# EasyEDA Pro project JP_SENSOR.eprj

# Schematic Schematic1
Board Name: Board1; Create Date: 2025-06-28; Page Name: P2; Project Name: JP_Sensor; Schematic Name: Schematic1; Update Date: 2025-08-31; Company: EasyEDA.com; Page Size: A4; Version: V1.0
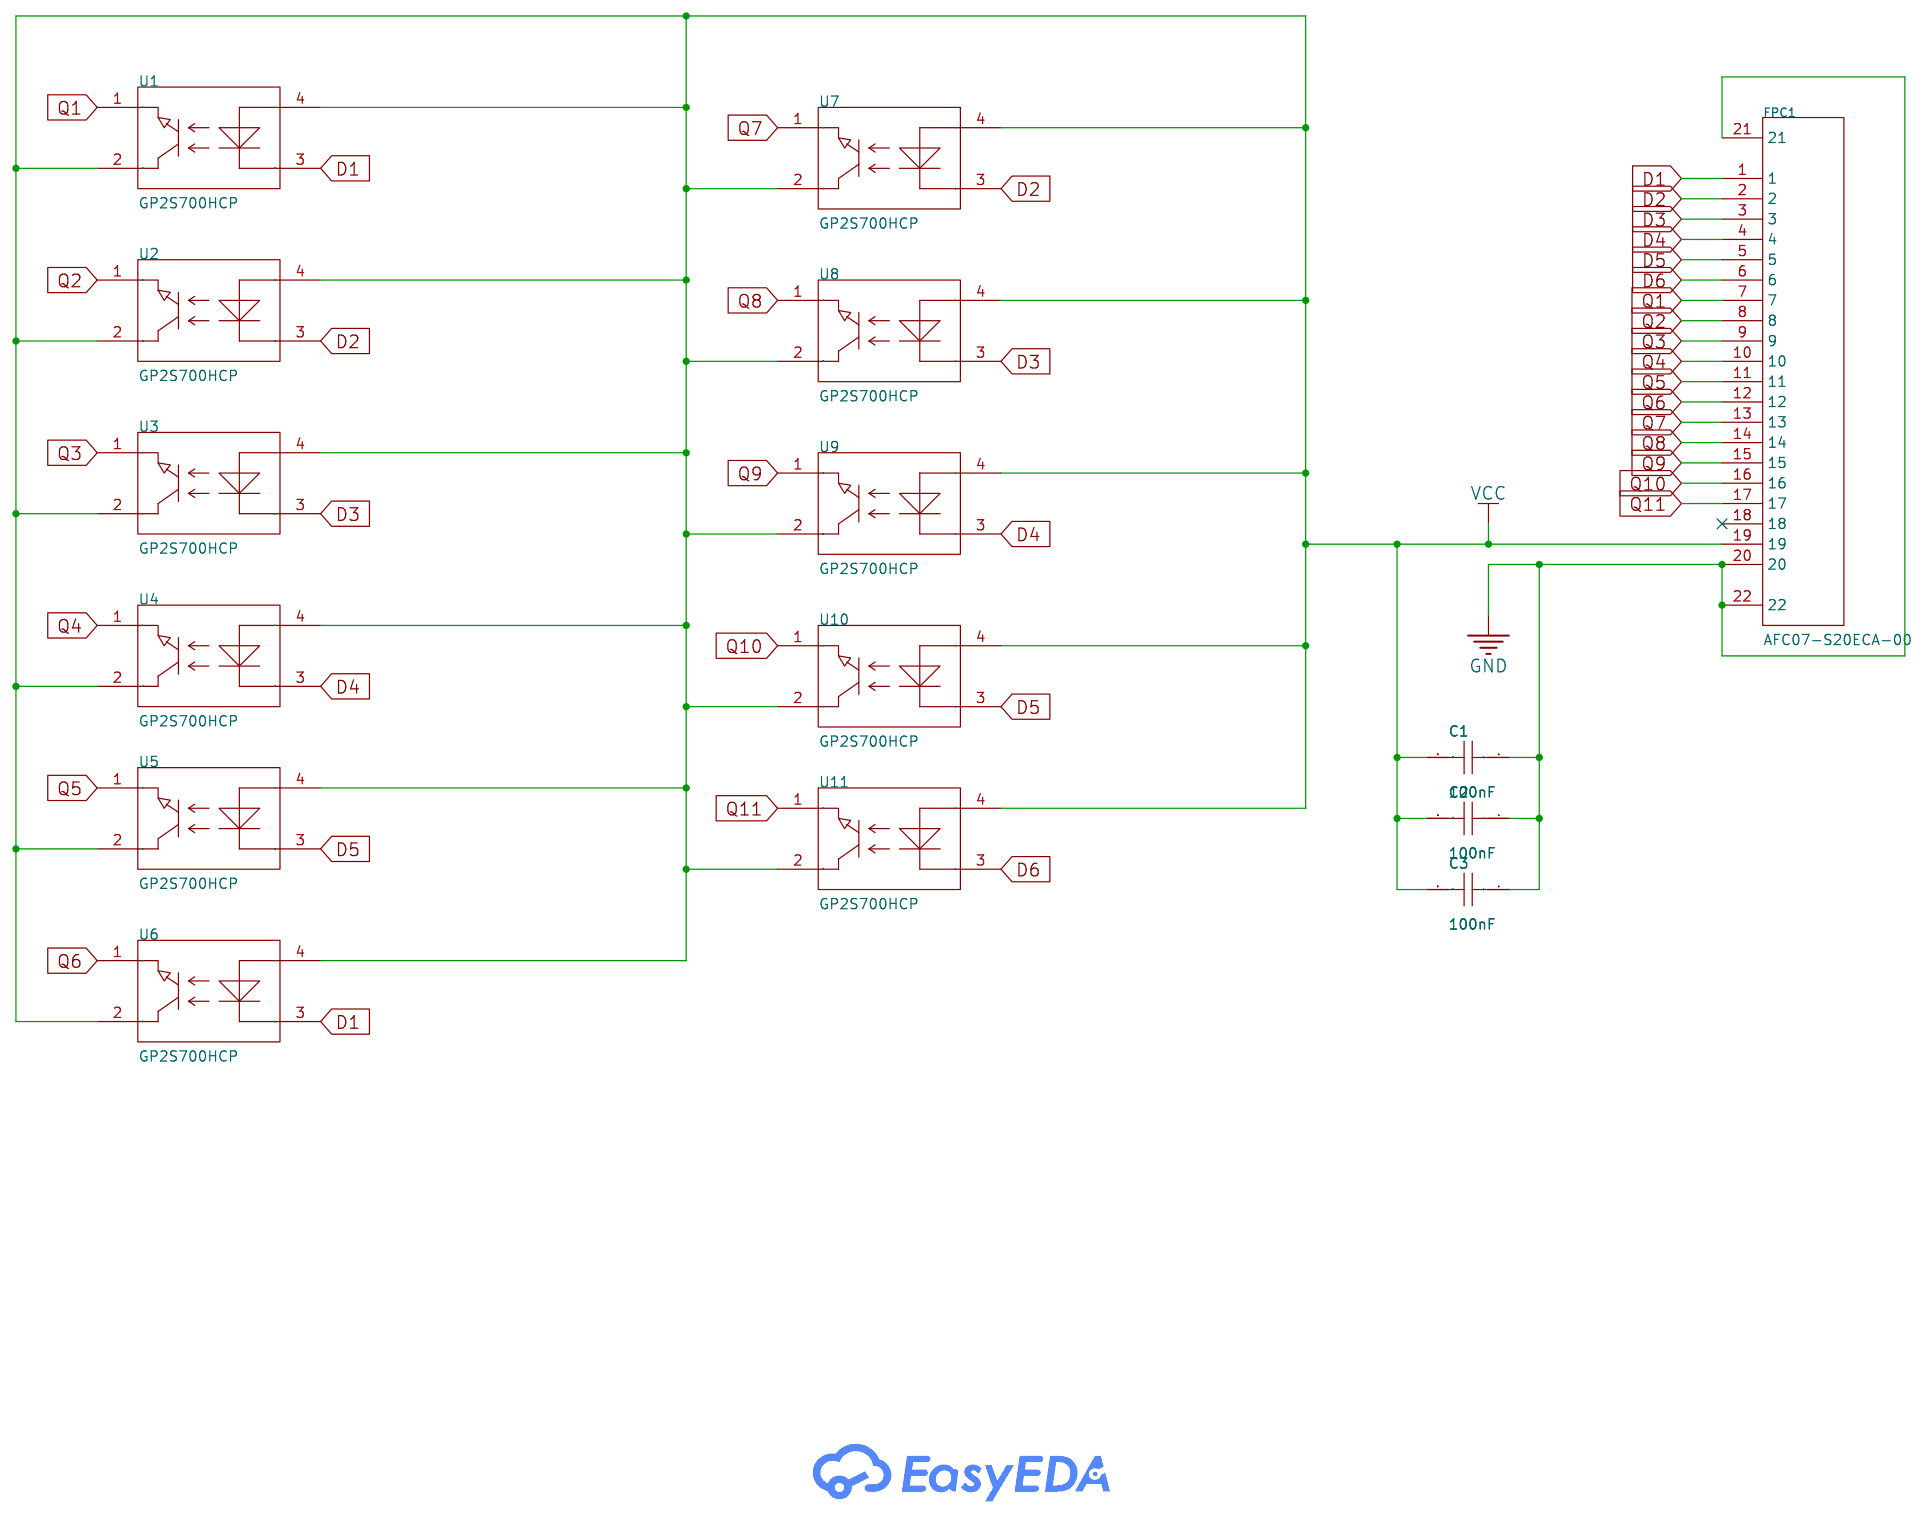
[diagram p0: schematic sheet]

## Parts
C1  100nF  [C0603]
C2  100nF  [C0603]
C3  100nF  [C0603]
FPC1  AFC07-S20ECA-00  [FPC-SMD_AFC07-S20ECA-00]
U1  GP2S700HCP  [OPTO-SMD_GP2S700HCP]
U2  GP2S700HCP  [OPTO-SMD_GP2S700HCP]
U3  GP2S700HCP  [OPTO-SMD_GP2S700HCP]
U4  GP2S700HCP  [OPTO-SMD_GP2S700HCP]
U5  GP2S700HCP  [OPTO-SMD_GP2S700HCP]
U6  GP2S700HCP  [OPTO-SMD_GP2S700HCP]
U7  GP2S700HCP  [OPTO-SMD_GP2S700HCP]
U8  GP2S700HCP  [OPTO-SMD_GP2S700HCP]
U9  GP2S700HCP  [OPTO-SMD_GP2S700HCP]
U10  GP2S700HCP  [OPTO-SMD_GP2S700HCP]
U11  GP2S700HCP  [OPTO-SMD_GP2S700HCP]

## Library data of the parts
C1-C3 = CAP_0603: Supplier Footprint: 0603
FPC1 = AFC07-S20ECA-00: LCSC Part Name: 间距:0.5mm P数:20P 抽屉式 上接; Supplier Part: C262641; Manufacturer: JS(钜硕电子); Supplier Footprint: SMD,P=0.5mm,卧贴; JLCPCB Part Class: Extended Part; Datasheet: https://atta.szlcsc.com/upload/public/pdf/source/20190726/C11082_A2E7B12387019CE4314BB5199EE0FDF4.pdf; Supplier: LCSC; Locking Feature: 抽屉式; Contact Type: Contact,Top; Number of Contacts: 20P; Pitch: 0.5mm; Mounting Type: 卧贴; FFC, FCB Thickness: 0.3mm; Height Above Board: 2mm
U1-U11 = GP2S700HCP: Sensing Distance:5.5mm Collector Current (Max):20mA; Supplier Part: C84392; Manufacturer: SHARP(夏普); Supplier Footprint: SMD-4P; JLCPCB Part Class: Extended Part; Datasheet: https://atta.szlcsc.com/upload/public/pdf/source/20180614/C84392_04826074CB7AA100700AE9A13738AF35.pdf; Supplier: LCSC; Sensing Distance: 5.5mm; Collector Current (Max): 20mA

## Nets
GND: C1.1 C2.1 C3.1 FPC1.20 FPC1.21 FPC1.22
VCC: C1.2 C2.2 C3.2 FPC1.19 U1.2 U1.4 U2.2 U2.4 U3.2 U3.4 U4.2 U4.4 U5.2 U5.4 U6.2 U6.4 U7.2 U7.4 U8.2 U8.4 U9.2 U9.4 U10.2 U10.4 U11.2 U11.4
D1: FPC1.1 U1.3 U6.3
D2: FPC1.2 U2.3 U7.3
D3: FPC1.3 U3.3 U8.3
D4: FPC1.4 U4.3 U9.3
D5: FPC1.5 U5.3 U10.3
D6: FPC1.6 U11.3
Q1: FPC1.7 U1.1
Q2: FPC1.8 U2.1
Q3: FPC1.9 U3.1
Q4: FPC1.10 U4.1
Q5: FPC1.11 U5.1
Q6: FPC1.12 U6.1
Q7: FPC1.13 U7.1
Q8: FPC1.14 U8.1
Q9: FPC1.15 U9.1
Q10: FPC1.16 U10.1
Q11: FPC1.17 U11.1

Not connected (* = marked no-connect by the designer): FPC1 18*

# Board PCB1
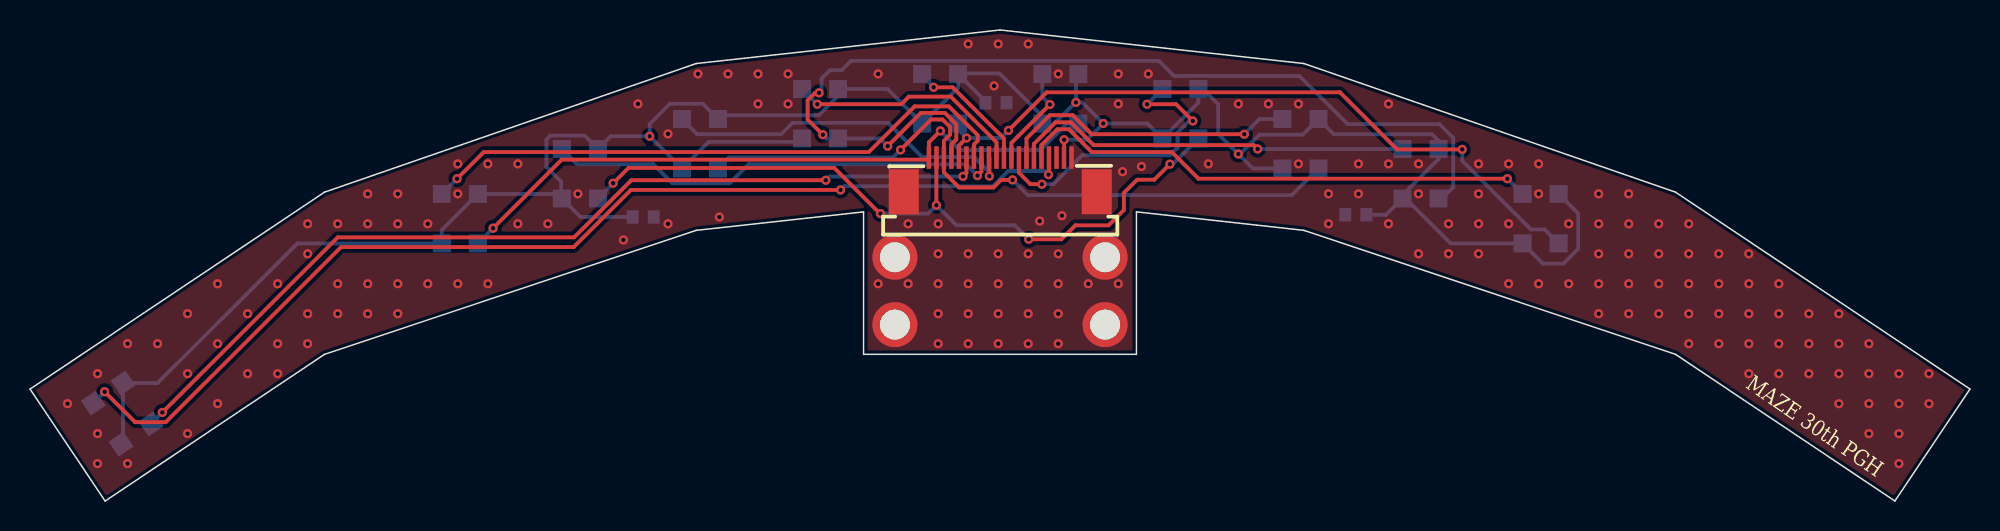
[diagram p1: board, top side]
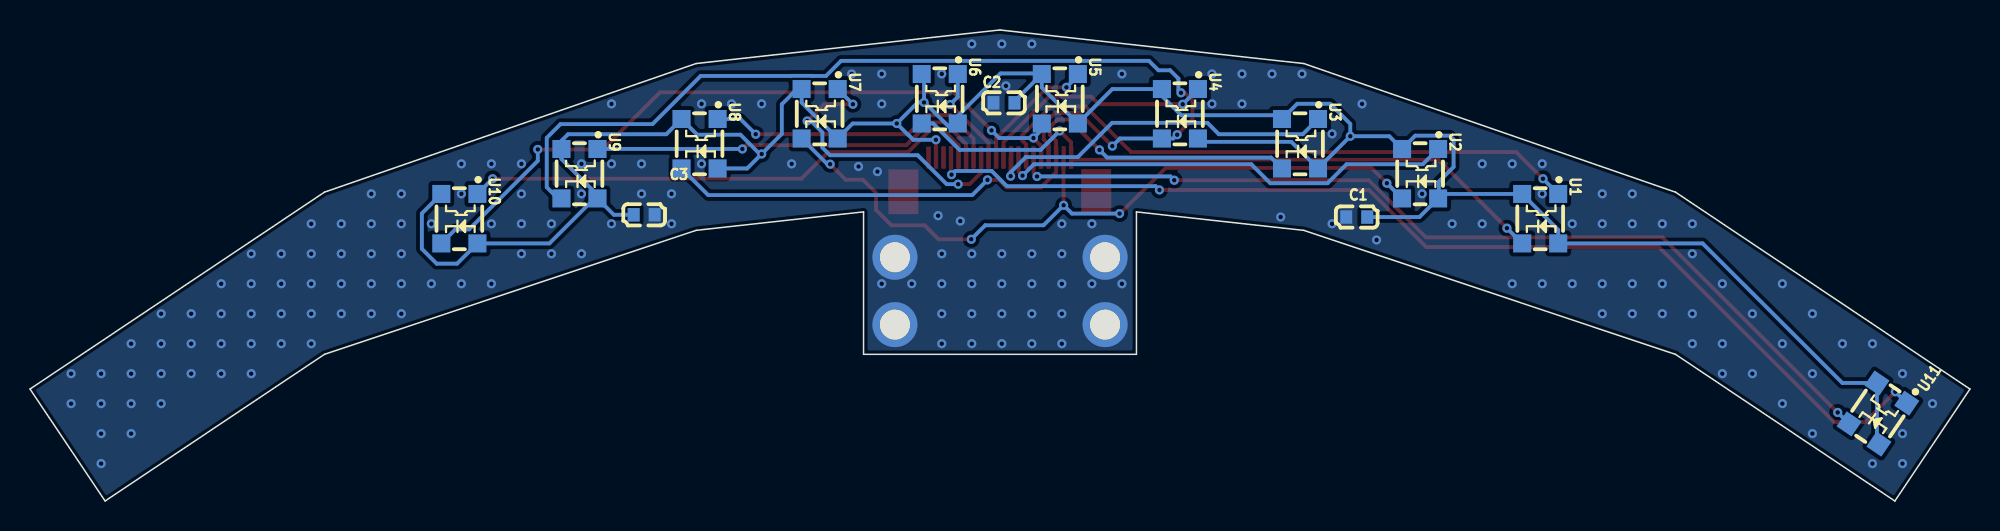
[diagram p2: board, bottom side, seen from below]

Outline 129.23 x 31.43 mm; copper layers: Top Layer, Bottom Layer. Coordinates in mm from the lower left corner of the outline.
Outline path: 5,0 0,7.47 19.62,20.61 44.37,29.19 64.62,31.43 84.86,29.19 109.62,20.61 129.23,7.47 124.23,0 109.62,9.79 84.86,18.06 73.71,19.29 73.71,9.79 55.53,9.79 55.53,19.29 44.37,18.06 19.62,9.79 5,0
Stack: Top Layer 0.035mm / Dielectric1 1.51mm FR4 er 4.5 / Bottom Layer 0.035mm

## Design rules (mm)
template: Custom Config
spacing copperThickness1oz (default): track to track 0.102, other pairs 0.152 to 0.3
spacing copperThickness2oz: track to track 0.203, other pairs 0.152 to 0.3
track width copperThickness1oz (default): min 0.127, default 0.254, max 2.54
track width copperThickness2oz: min 0.203, default 0.254, max 2.54
track width VCC: min 0.2, default 0.3, max 0.5
differential pair differentialPair (default): width min 0.127, default 0.254, max 2.54; gap min 0.152, default 0.152
via viaSize (default): diameter min 0.5, default 0.61, max 10; hole min 0.3, default 0.305, max 6.3

## Placement (name value [footprint] x y rotation side)
C1  100nF  [C0603]  40.85 18.95 180 bottom
C2  100nF  [C0603]  64.35 26.57 180 bottom
C3  100nF  [C0603]  88.32 19.1 0 bottom
FPC1  AFC07-S20ECA-00  [FPC-SMD_AFC07-S20ECA-00]  64.63 21.78 0 top
NOREF  -  [Pad_e153]  57.62 11.77 0 top
NOREF#2  -  [Pad_e155]  71.62 16.26 0 top
NOREF#3  -  [Pad_e154]  71.62 11.77 0 top
NOREF#4  -  [Pad_e152]  57.62 16.26 0 top
U1  GP2S700HCP  [OPTO-SMD_GP2S700HCP]  28.63 18.84 270 bottom
U2  GP2S700HCP  [OPTO-SMD_GP2S700HCP]  36.63 21.84 270 bottom
U3  GP2S700HCP  [OPTO-SMD_GP2S700HCP]  44.63 23.84 270 bottom
U4  GP2S700HCP  [OPTO-SMD_GP2S700HCP]  52.63 25.84 270 bottom
U5  GP2S700HCP  [OPTO-SMD_GP2S700HCP]  60.63 26.84 270 bottom
U6  GP2S700HCP  [OPTO-SMD_GP2S700HCP]  68.63 26.84 270 bottom
U7  GP2S700HCP  [OPTO-SMD_GP2S700HCP]  76.63 25.84 270 bottom
U8  GP2S700HCP  [OPTO-SMD_GP2S700HCP]  84.63 23.84 270 bottom
U9  GP2S700HCP  [OPTO-SMD_GP2S700HCP]  92.63 21.84 270 bottom
U10  GP2S700HCP  [OPTO-SMD_GP2S700HCP]  100.63 18.84 270 bottom
U11  GP2S700HCP  [OPTO-SMD_GP2S700HCP]  6.13 5.84 304.2 bottom

## Footprints (pads in the part's own frame, mm; a bottom-side part is the same pattern mirrored in y, then rotated)
C0603
  rect 0.8x0.9 smd: 1(-0.7,0) 2(0.7,0)
FPC-SMD_AFC07-S20ECA-00
  rect 0.3x1.5 smd: 1(-4.751,1.141) 2(-4.251,1.141) 3(-3.752,1.141) 4(-3.251,1.141) 5(-2.752,1.141) 6(-2.251,1.141) 7(-1.752,1.141) 8(-1.251,1.141) 9(-0.751,1.141) 10(-0.251,1.141) 11(0.248,1.141) 12(0.749,1.141) 13(1.248,1.141) 14(1.749,1.141) 15(2.245,1.14) 16(2.748,1.141) 17(3.248,1.141) 18(3.748,1.141) 19(4.248,1.141) 20(4.75,1.138)
  rect 2x3 smd: 21(-6.427,-1.141) 22(6.427,-1.141)
OPTO-SMD_GP2S700HCP
  rect 1.2x1.2 smd: 1(-1.65,1.2) 2(-1.65,-1.2) 3(1.65,-1.2) 4(1.65,1.2)
Pad_e152
  round 3 hole 2: 1(0,0)
Pad_e153
  round 3 hole 2: 2(0,0)
Pad_e154
  round 3 hole 2: 3(0,0)
Pad_e155
  round 3 hole 2: 4(0,0)

## Nets
As in the schematic, except:
GND: C1.1 C2.1 C3.1 FPC1.20 FPC1.21 FPC1.22 NOREF.2 NOREF#2.4 NOREF#3.3 NOREF#4.1

Pads without a net: FPC1 18

## Via types
v1: diameter 0.61, hole 0.305, Top Layer to Bottom Layer, 210 vias

## Routing (per net, layer and track width the routed paths; a pad name or vN(x,y) marks a point on that pad's centre or on a via; arc(x,y) is an arc through that point)
GND:
  vias: v1(2.5,6.5) v1(4.5,8.5) v1(4.5,4.5) v1(4.5,2.5) v1(6.5,10.5) v1(6.5,2.5) v1(8.5,10.5) v1(10.5,12.5) v1(10.5,8.5) v1(10.5,4.5) v1(12.5,14.5) v1(12.5,10.5) v1(12.5,6.5) v1(14.5,12.5) v1(14.5,8.5) v1(16.5,14.5) v1(16.5,10.5) v1(16.5,8.5) v1(18.5,18.5) v1(18.5,16.5) v1(18.5,12.5) v1(18.5,10.5) v1(20.5,18.5) v1(20.5,14.5) v1(20.5,12.5) v1(22.5,20.5) v1(22.5,18.5) v1(22.5,14.5) v1(22.5,12.5) v1(24.5,20.5) v1(24.5,18.5) v1(24.5,14.5) v1(24.5,12.5) v1(26.5,18.5) v1(26.5,14.5) v1(28.5,22.5) v1(28.5,20.5) v1(28.5,14.5) v1(30.5,22.5) v1(30.5,14.5) v1(32.5,22.5) v1(32.5,18.5) v1(34.5,18.5) v1(36.5,20.5) v1(39.53,17.42) v1(40.5,26.5) v1(42.5,24.5) v1(42.5,18.5) v1(44.5,28.5) v1(45.92,18.95) v1(46.5,28.5) v1(48.5,28.5) v1(48.5,26.5) v1(50.5,28.5) v1(50.5,26.5) v1(56.5,28.5) v1(56.5,14.5) v1(58.5,18.5) v1(58.5,14.5) v1(60.5,18.5) v1(60.5,16.5) v1(60.5,14.5) v1(60.5,12.5) v1(60.5,10.5) v1(62.5,30.5) v1(62.5,16.5) v1(62.5,14.5) v1(62.5,12.5) v1(62.5,10.5) v1(64.22,27.7) v1(64.5,30.5) v1(64.5,16.5) v1(64.5,14.5) v1(64.5,12.5) v1(64.5,10.5) v1(66.5,30.5) v1(66.5,16.5) v1(66.5,14.5) v1(66.5,12.5) v1(66.5,10.5) v1(67.26,18.68) v1(68.5,28.5) v1(68.5,16.5) v1(68.5,14.5) v1(68.5,12.5) v1(68.5,10.5) v1(68.74,19.04) v1(70.5,14.5) v1(72.5,28.5) v1(72.5,26.5) v1(72.5,14.5) v1(72.78,21.98) v1(74.04,22.32) v1(74.5,28.5) v1(78.5,22.5) v1(80.5,26.5) v1(82.5,26.5) v1(84.5,26.5) v1(84.5,22.5) v1(86.5,20.5) v1(86.5,18.5) v1(88.5,22.5) v1(88.5,20.5) v1(90.5,26.5) v1(90.5,22.5) v1(90.5,18.5) v1(92.5,22.5) v1(92.5,20.5) v1(92.5,16.5) v1(94.5,18.5) v1(94.5,16.5) v1(96.5,22.5) v1(96.5,20.5) v1(96.5,18.5) v1(96.5,16.5) v1(98.5,22.5) v1(98.5,18.5) v1(98.5,14.5) v1(100.5,22.5) v1(100.5,20.5) v1(100.5,14.5) v1(102.5,18.5) v1(102.5,14.5) v1(104.5,20.5) v1(104.5,18.5) v1(104.5,16.5) v1(104.5,14.5) v1(104.5,12.5) v1(106.5,20.5) v1(106.5,18.5) v1(106.5,16.5) v1(106.5,14.5) v1(106.5,12.5) v1(108.5,18.5) v1(108.5,16.5) v1(108.5,14.5) v1(108.5,12.5) v1(110.5,18.5) v1(110.5,16.5) v1(110.5,14.5) v1(110.5,12.5) v1(110.5,10.5) v1(112.5,16.5) v1(112.5,14.5) v1(112.5,12.5) v1(112.5,10.5) v1(114.5,16.5) v1(114.5,14.5) v1(114.5,12.5) v1(114.5,10.5) v1(114.5,8.5) v1(116.5,14.5) v1(116.5,12.5) v1(116.5,10.5) v1(116.5,8.5) v1(118.5,12.5) v1(118.5,10.5) v1(118.5,8.5) v1(120.5,12.5) v1(120.5,10.5) v1(120.5,8.5) v1(120.5,6.5) v1(122.5,10.5) v1(122.5,8.5) v1(122.5,6.5) v1(122.5,4.5) v1(124.5,8.5) v1(124.5,6.5) v1(124.5,4.5) v1(124.5,2.5) v1(126.5,8.5) v1(126.5,6.5)
VCC: length 174.7
  Top Layer w0.254: FPC1.19 68.89,22.93 v1(68.89,24.1)
  Bottom Layer w0.254: U6.4 67.5,25.25 67.5,25.61 64.58,28.53 61.75,28.53 61.46,28.24 61.36,28.24 ; v1(71.49,25.19) 70.73,24.43 70.72,24.43 70.4,24.1 v1(68.89,24.1) ; v1(71.49,25.19) 74.43,25.19 U7.4 77.83,26.59 U7.2 78.13,27.49 79.15,26.47 79.15,24.49 v1(80.49,23.15) ; v1(71.49,25.19) 70.09,26.59 v1(69.68,26.59) ; v1(80.49,23.15) 80.62,23.15 81.91,24.44 84.78,24.44 U8.2 86.85,24.47 93.39,24.47 93.83,24.03 93.83,22.82 91.41,20.4 94.63,17.19 U10.4 100.78,15.84 102.14,15.84 103.13,16.82 103.13,19.19 U10.2 ; v1(80.49,23.15) 81.46,22.19 U8.4 ; U4.4 51.21,23.97 45.21,23.97 U3.4 v1(41.28,24.34) ; U6.2 69.68,28.33 v1(69.68,26.59) ; C2.2 63.65,26.67 U5.2 61.83,27.59 U5.4 57.13,27.49 U4.2 ; 67.18,24.94 67.28,24.83 67.88,24.83 69.64,26.59 v1(69.68,26.59) ; v1(41.28,24.34) 38.68,24.34 U2.2 36.95,24.38 34.66,24.38 34.4,24.12 34.4,22.29 35.38,21.31 35.38,20.24 35.13,20.49 U1.2 27.43,18.09 U1.4 17.81,17.19 8.5,7.88 U11.2 6.2,3.93 U11.4 ; v1(41.28,24.34) 41.28,25.16 42.62,26.5 44.81,26.5 U3.2 46.08,25.74 52.54,25.74 53.78,26.98 ; U2.4 36.67,18.95 C1.2 ; U9.4 90.34,19.1 C3.2
D1: length 45
  Top Layer w0.254: v1(30.85,18.2) 35.42,22.78 59.74,22.78 FPC1.1 59.88,23.93 v1(60.64,24.69)
  Bottom Layer w0.254: U6.3 69.07,25.19 67.31,23.42 61.91,23.42 v1(60.64,24.69) ; U1.3 v1(30.85,18.2)
D2: length 49.8
  Top Layer w0.254: v1(38.85,21.2) 39.86,22.22 53.58,22.22 56.62,19.18 v1(56.65,19.18) ; v1(75.93,22.47) 74.89,21.44 73.75,21.44 72.87,20.55 72.87,19.41 71.85,18.4 69.64,18.4 68.71,17.46 v1(66.53,17.46) ; 60.38,19.88 FPC1.2
  Bottom Layer w0.254: v1(66.53,17.46) 65.6,18.4 61.71,18.4 v1(60.38,19.73) 59.82,19.18 v1(56.65,19.18) ; U7.3 76.12,22.47 v1(75.93,22.47) ; U2.3 v1(38.85,21.2)
D3: length 47
  Top Layer w0.254: v1(57.99,23.42) 60.02,25.46 60.78,25.46 61.29,24.95 61.29,24.44 60.88,24.03 FPC1.3 60.88,21.93 61.89,20.92 64.18,20.92 64.69,21.43 v1(65.45,21.43)
  Bottom Layer w0.254: v1(65.45,21.43) 66.47,20.41 84.05,20.41 U8.3 ; v1(57.99,23.42) 57.48,22.92 46.56,22.92 U3.3
D4: length 66.8
  Top Layer w0.254: v1(57.13,23.68) 59.35,25.89 60.94,25.89 61.7,25.13 61.7,24.12 61.38,23.79 FPC1.4 ; v1(52.56,27.24) 52.31,27.24 51.8,26.73 51.8,25.46 v1(52.81,24.44)
  Bottom Layer w0.254: v1(52.81,24.44) 53.07,24.19 U4.3 56.62,24.19 v1(57.13,23.68) ; U9.3 94.06,20.19 94.81,20.94 94.81,24.23 93.89,25.15 87.77,25.15 84.55,28.36 78.55,28.36 78.55,28.37 77.11,28.37 77.11,28.36 76.21,28.36 75.2,29.37 54.69,29.37 54.06,28.74 53.28,28.74 52.73,28.19 52.73,27.41 v1(52.56,27.24)
D5: length 48
  Top Layer w0.254: FPC1.5 61.88,23.71 v1(62.39,24.22) ; v1(95.41,23.46) 91.07,23.46 87.26,27.27 67.72,27.27 v1(65.18,24.73)
  Bottom Layer w0.254: U5.3 61.83,24.78 v1(62.39,24.22) 64.67,24.22 v1(65.18,24.73) ; U10.3 100.89,18.12 99.98,18.12 95.41,22.7 v1(95.41,23.46)
D6: length 62.3
  Top Layer w0.254: v1(8.81,5.91) 20.5,17.59 36.24,17.59 40.05,21.4 v1(53.01,21.4) ; FPC1.6 62.38,21.88 v1(62.15,21.66)
  Bottom Layer w0.254: U11.3 v1(8.81,5.91) ; v1(62.15,21.66) 53.26,21.66 v1(53.01,21.4)
Q1: length 40.5
  Top Layer w0.254: FPC1.7 62.88,23.79 63.13,24.04 63.13,24.41 61.21,26.33 58.93,26.33 55.88,23.28 30.22,23.28 v1(28.45,21.5)
  Bottom Layer w0.254: U1.1 v1(28.45,21.5)
Q2: length 30.8
  Top Layer w0.254: v1(63.12,21.71) 63.38,21.97 FPC1.8
  Bottom Layer w0.254: v1(63.12,21.71) 62.35,22.47 47.88,22.47 46.61,21.2 42.8,21.2 41.53,22.47 36.45,22.47 U2.1
Q3: length 24.1
  Top Layer w0.254: v1(63.91,21.68) 63.91,22.89 FPC1.9
  Bottom Layer w0.254: v1(63.91,21.68) 63.91,21.93 62.89,22.95 59.43,22.95 57.15,25.23 50.8,25.23 50.03,24.47 44.45,24.47 U3.1
Q4: length 15.9
  Top Layer w0.254: FPC1.10 64.38,23.93 61.34,26.98 58.54,26.98 58.03,26.47 v1(52.45,26.47)
  Bottom Layer w0.254: U4.1 v1(52.45,26.47)
Q5: length 8.6
  Top Layer w0.254: FPC1.11 64.88,24.19 61.46,27.6 v1(60.19,27.6)
  Bottom Layer w0.254: U5.1 59.43,28.37 v1(60.19,27.6)
Q6: length 6.8
  Top Layer w0.254: v1(67.94,26.46) 65.38,23.9 FPC1.12
  Bottom Layer w0.254: v1(67.94,26.46) 67.43,26.96 U6.1
Q7: length 20.2
  Top Layer w0.254: v1(74.41,26.47) 76.35,26.47 v1(77.46,25.36) ; v1(67.4,21.14) 66.64,21.14 65.88,21.9 FPC1.13
  Bottom Layer w0.254: v1(67.4,21.14) 68.17,21.14 70.1,23.07 75.94,23.07 76.45,23.58 76.45,24.59 77.21,25.36 v1(77.46,25.36) ; U7.1 v1(74.41,26.47)
Q8: length 19.9
  Top Layer w0.254: FPC1.14 66.38,24.18 67.94,25.74 69.46,25.74 70.73,24.47 v1(80.89,24.47)
  Bottom Layer w0.254: v1(80.89,24.47) 81.91,25.49 U8.1
Q9: length 26.8
  Top Layer w0.254: FPC1.15 66.88,23.82 68.32,25.27 69.33,25.27 70.86,23.74 81.52,23.74 v1(81.78,23.49)
  Bottom Layer w0.254: U9.1 v1(81.78,23.49)
Q10: length 35.1
  Top Layer w0.254: v1(98.41,21.5) 77.84,21.5 76.06,23.28 70.73,23.28 69.2,24.81 68.44,24.81 67.38,23.74 FPC1.16
  Bottom Layer w0.254: U10.1 v1(98.41,21.5)
Q11: length 73
  Top Layer w0.254: v1(53.99,20.75) 40.02,20.75 36.22,16.94 20.72,16.94 9.04,5.26 7,5.26 v1(4.97,7.29) ; v1(67.84,21.77) 67.88,21.81 FPC1.17
  Bottom Layer w0.254: U11.1 v1(4.97,7.29) ; v1(53.99,20.75) 54.25,21.01 64.15,21.01 65.17,22.02 67.6,22.02 v1(67.84,21.77)

## Copper pours and planes (outline as drawn; the poured copper is in the pictures)
GND on Top Layer: -13.39,42.78 133.79,42.78 133.79,-15.09 -13.39,-15.09
GND on Bottom Layer: -8.7,40.81 136.03,40.81 136.03,-8.1 -8.7,-8.1

## Text on the board
Top Silkscreen Layer: MAZE 30th PGH
